# Altium schematic sheet PMSM_PDFan.SchDoc
size D; SheetNumber: 1; SheetTotal: 1
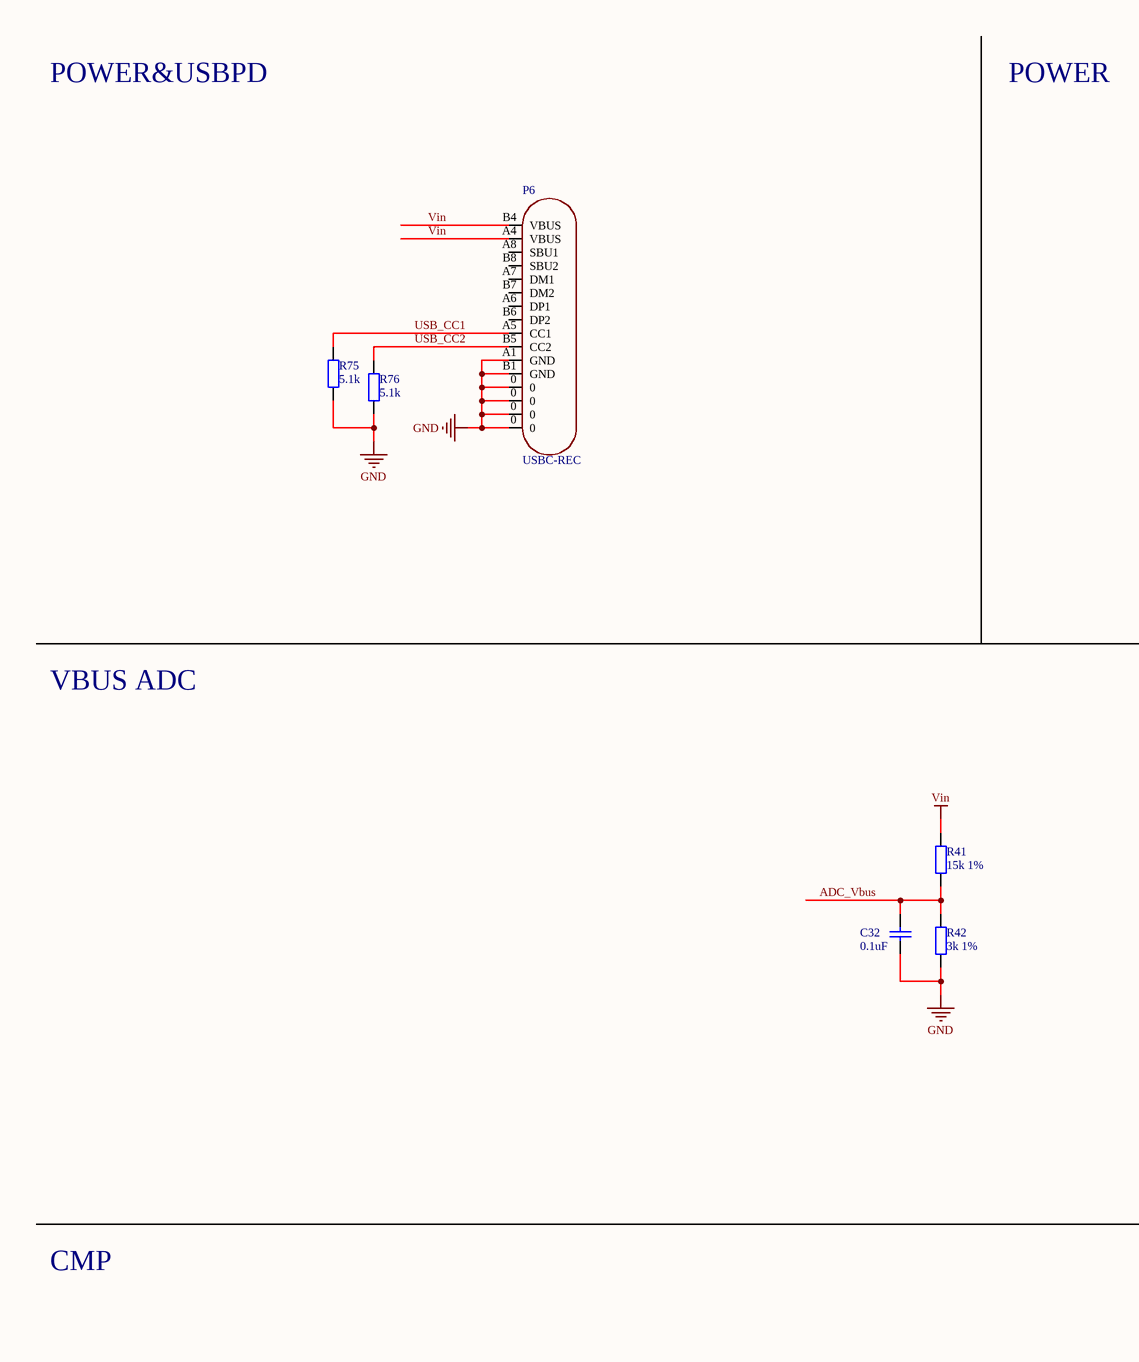
[diagram p0: PMSM_PDFan.SchDoc, top left]
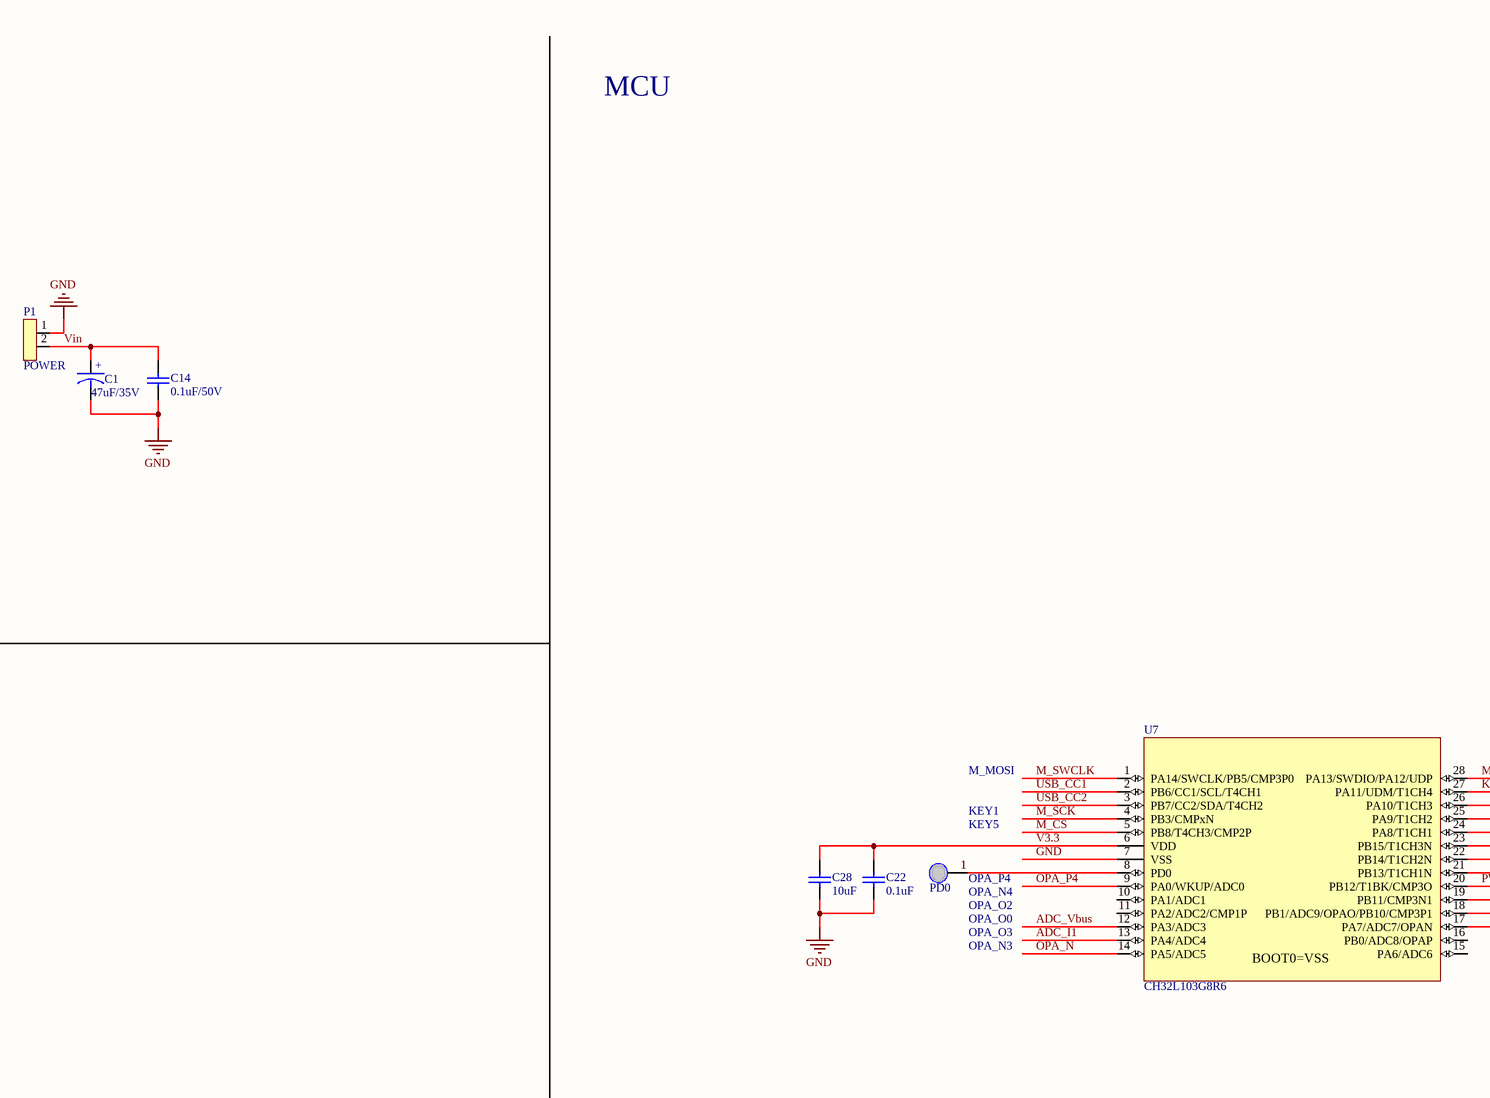
[diagram p1: PMSM_PDFan.SchDoc, top middle]
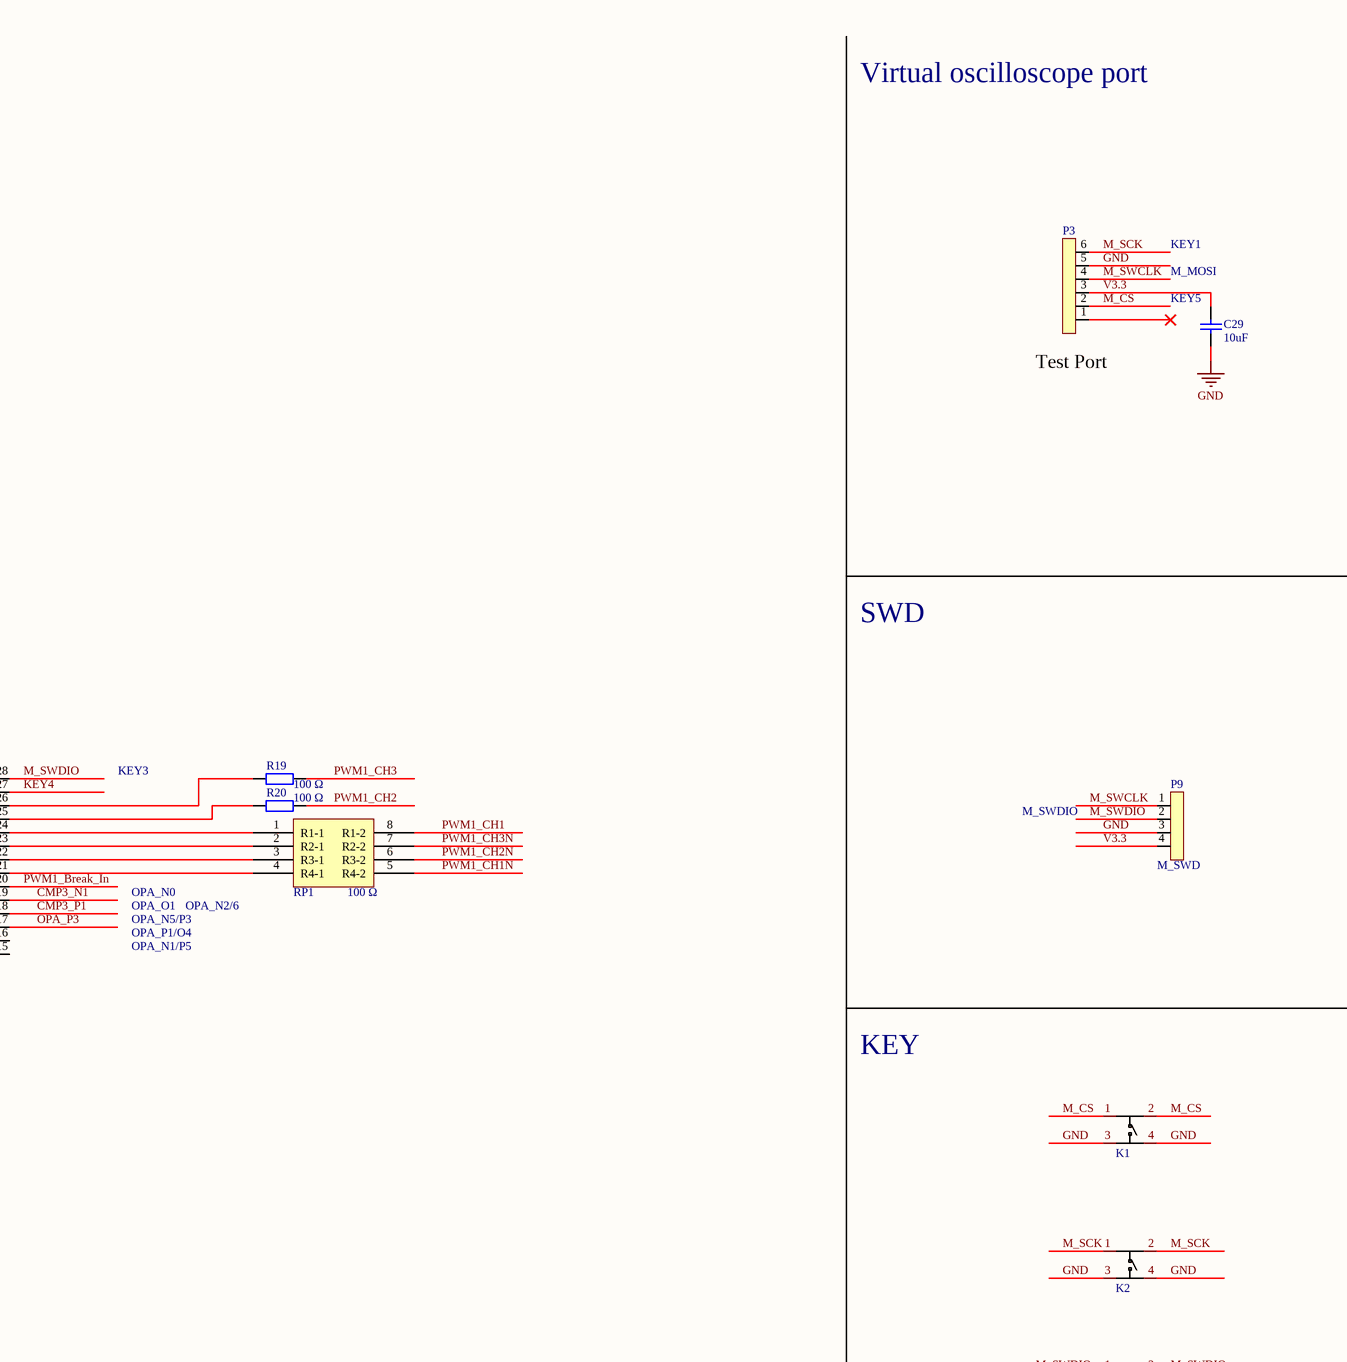
[diagram p2: PMSM_PDFan.SchDoc, top right]
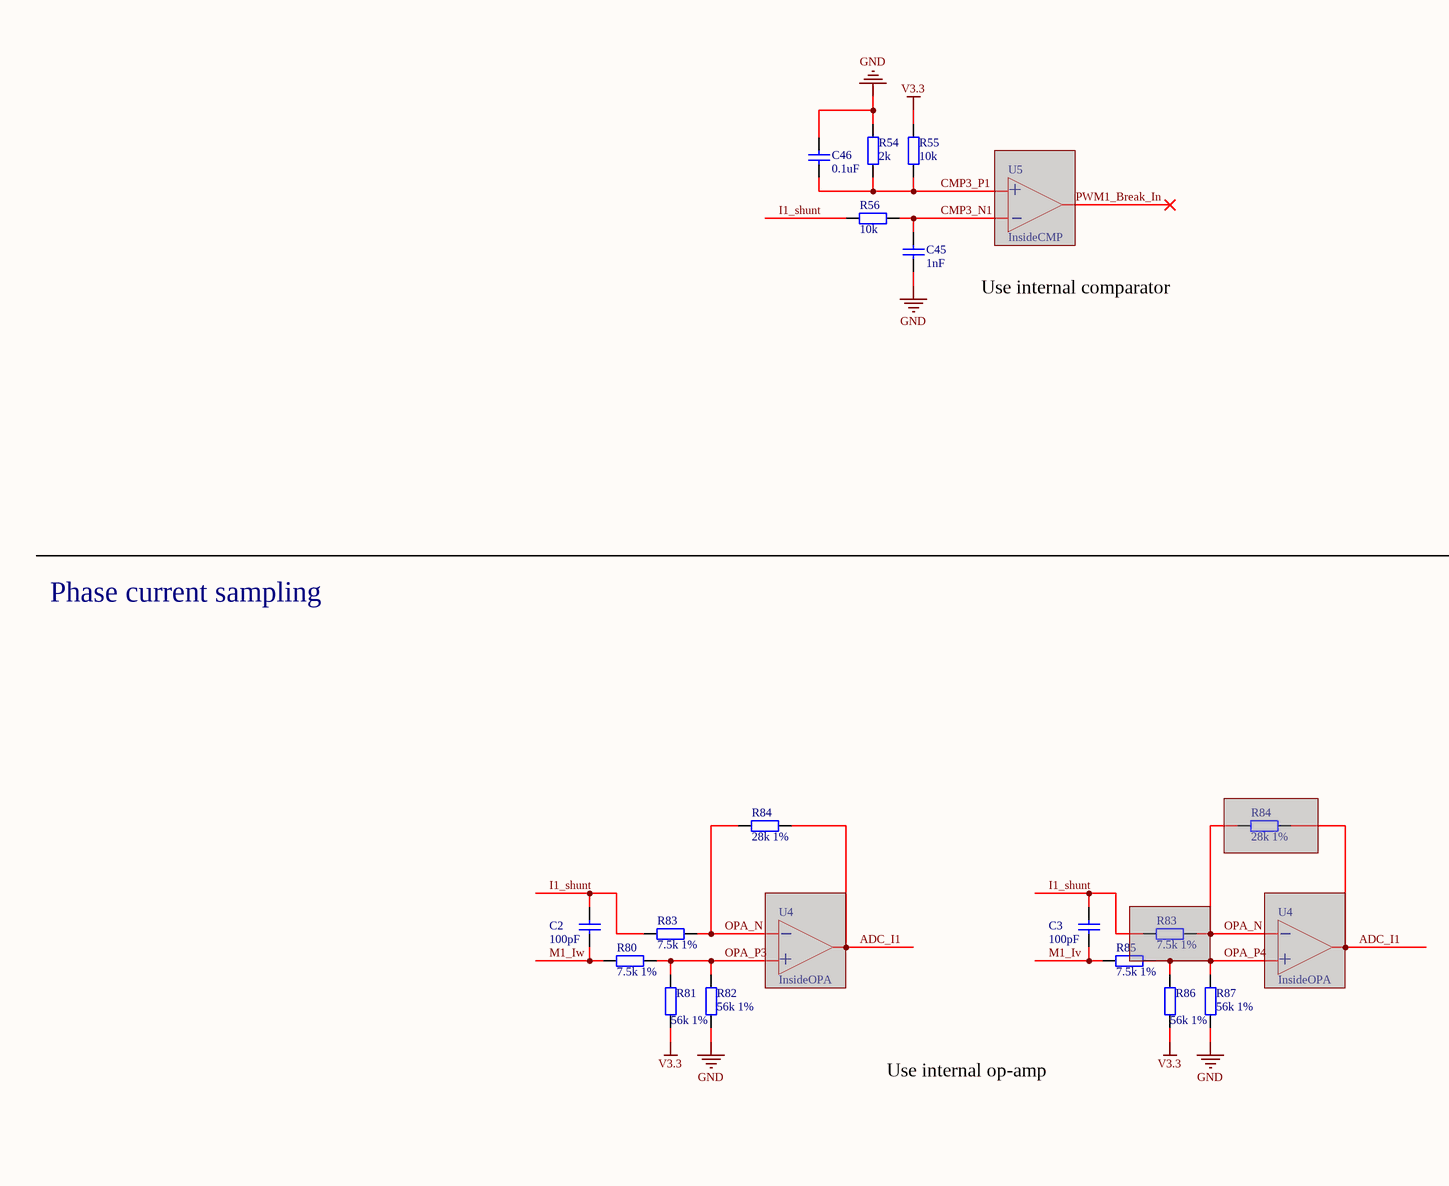
[diagram p3: PMSM_PDFan.SchDoc, bottom left]
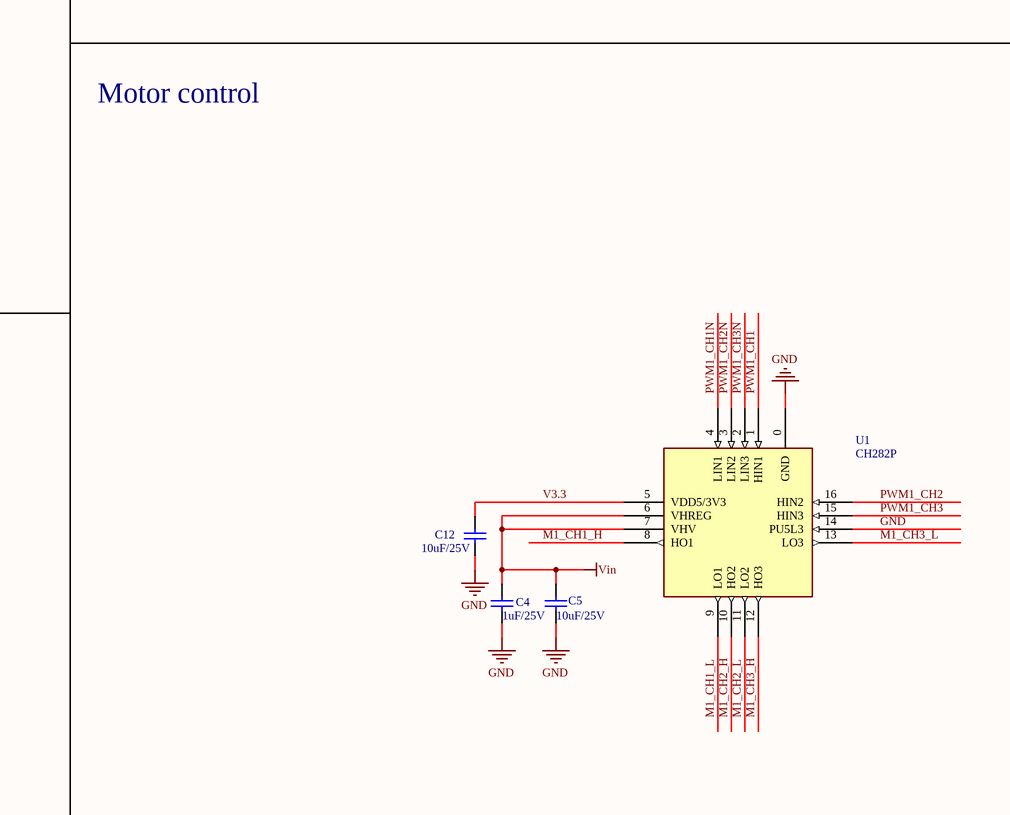
[diagram p4: PMSM_PDFan.SchDoc, bottom middle]
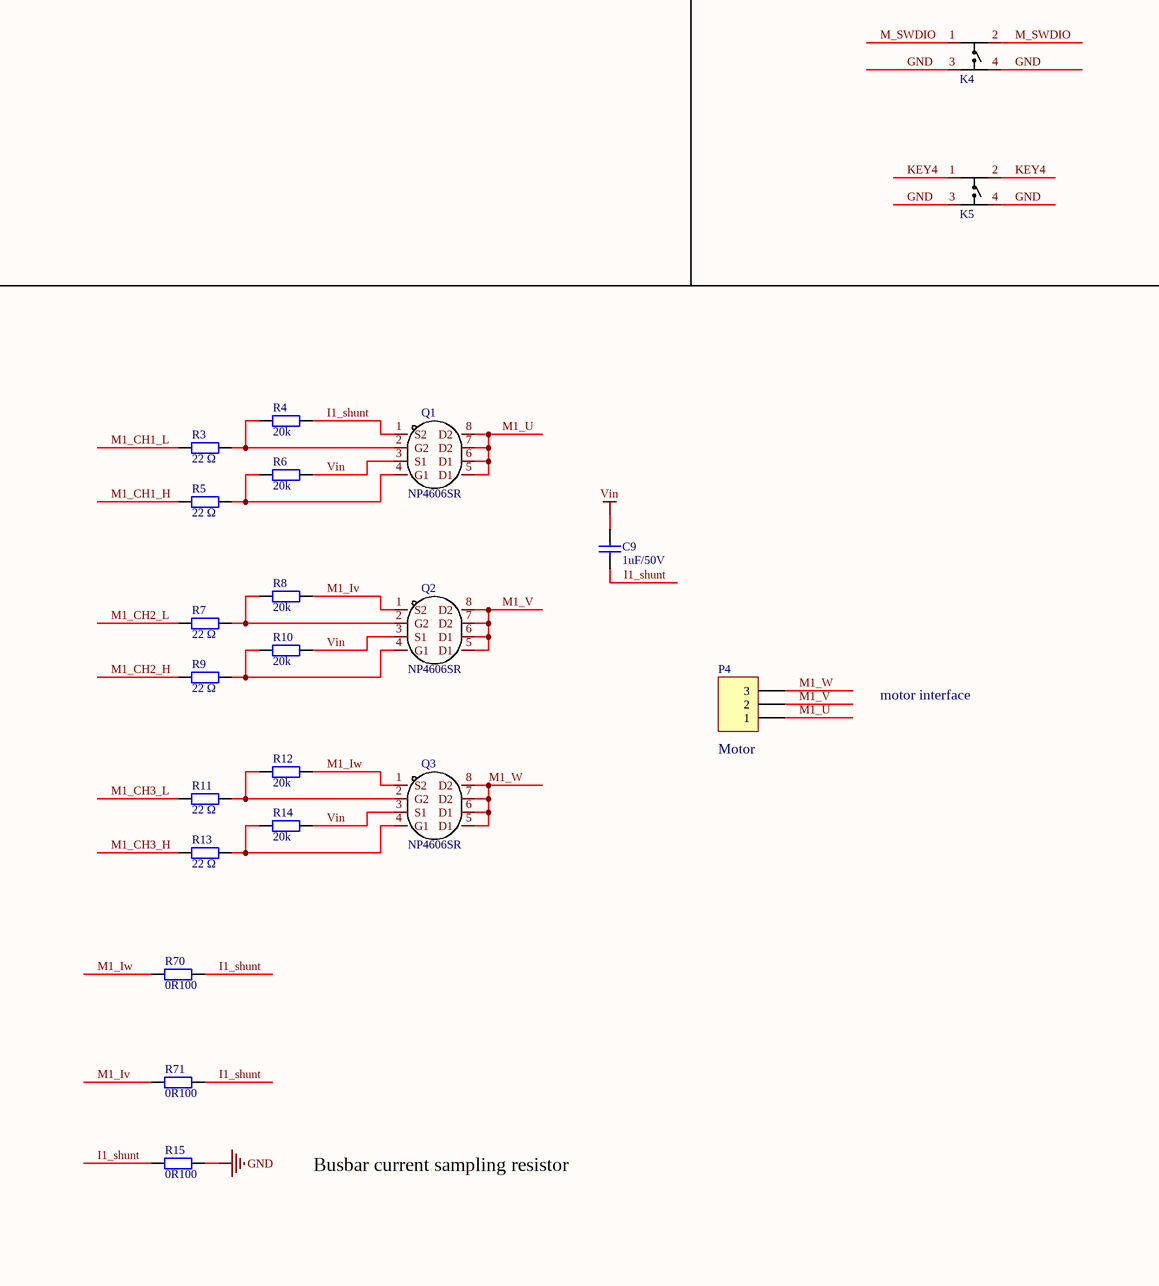
[diagram p5: PMSM_PDFan.SchDoc, bottom right]

## Parts
(Parts that share a designator on the sheet are numbered #1, #2 ... from top to bottom, then left to right.)
C1  47uF/35V  [M_C_RB_D10F5]
C2  100pF  [M_C0402-]
C3  100pF  [M_C0402-]
C4  1uF/25V  [M_C0603]
C5  10uF/25V  [M_C0805]
C9  1uF/50V  [M_C0805]
C12  10uF/25V  [M_C0603]
C14  0.1uF/50V  [M_C0402-]
C22  0.1uF  [M_C0402-]
C28  10uF  [M_C0603]
C29  10uF  [M_C0603]
C32  0.1uF  [M_C0402-]
C45  1nF  [M_C0402-]
C46  0.1uF  [M_C0402-]
K1  KH-6X6X8H-STM  [KEY2-SMD]  (value not drawn)
K2  KH-6X6X8H-STM  [KEY2-SMD]  (value not drawn)
K4  KH-6X6X8H-STM  [KEY2-SMD]  (value not drawn)
K5  KH-6X6X8H-STM  [KEY2-SMD]  (value not drawn)
P1  POWER  [WJ15EDGRC3.81-2]
P3  6PIN  [M_PIN2.54_6P]  (value not drawn)
P4  MHDR1X3  [WJ15EDGRC3.81-3]  (value not drawn)
P6  USBC-REC  [TYPE-C-Receptacle-2.0]
P9  M_SWD  [M_PIN2.54_4P]
PD0  Testpoint  [TEST-1.2]  (value not drawn)
Q1  NP4606SR  [SOP8]
Q2  NP4606SR  [SOP8]
Q3  NP4606SR  [SOP8]
R3  22 Ω  [M_R0402-]
R4  20k  [M_R0402-]
R5  22 Ω  [M_R0402-]
R6  20k  [M_R0402-]
R7  22 Ω  [M_R0402-]
R8  20k  [M_R0402-]
R9  22 Ω  [M_R0402-]
R10  20k  [M_R0402-]
R11  22 Ω  [M_R0402-]
R12  20k  [M_R0402-]
R13  22 Ω  [M_R0402-]
R14  20k  [M_R0402-]
R15  0R100  [M_R1206-]
R19  100 Ω  [M_R0402-]
R20  100 Ω  [M_R0402-]
R41  15k 1%  [M_R0603]
R42  3k 1%  [M_R0402-]
R54  2k  [M_R0402-]
R55  10k  [M_R0402-]
R56  10k  [M_R0402-]
R70  0R100  [M_R1206-]
R71  0R100  [M_R1206-]
R75  5.1k  [M_R0402-]
R76  5.1k  [M_R0402-]
R80  7.5k 1%  [M_R0402-]
R81  56k 1%  [M_R0402-]
R82  56k 1%  [M_R0402-]
R83#1  7.5k 1%  [M_R0402-]
R83#2  7.5k 1%  [M_R0402-]  (masked out: inside a compile mask, not in the netlist)
R84#1  28k 1%  [M_R0402-]
R84#2  28k 1%  [M_R0402-]  (masked out: inside a compile mask, not in the netlist)
R85  7.5k 1%  [M_R0402-]
R86  56k 1%  [M_R0402-]
R87  56k 1%  [M_R0402-]
RP1  100 Ω  [M_RP0402]
U1  CH282P  [QFN16_3X3]
U4#1  InsideOPA  (masked out: inside a compile mask, not in the netlist)
U4#2  InsideOPA  (masked out: inside a compile mask, not in the netlist)
U5  InsideCMP  (masked out: inside a compile mask, not in the netlist)
U7  CH32L103G8R6  [QSOP28]

## Nets
GND: C1.2 C4.2 C5.2 C12.2 C14.2 C22.2 C28.2 C29.2 C32.2 C45.1 C46.2 K1.3(C) K1.4(D) K2.3(C) K2.4(D) K4.3(C) K4.4(D) K5.3(C) K5.4(D) P1.1 P3.5 P6.0 P6.A1(GND) P6.B1(GND) P9.3 R15.1 R42.1 R54.1 R75.1 R76.1 R82.1 R87.1 U1.0(GND) U1.14(PU5L3) U7.7(VSS)
V3.3: C12.1 C22.1 C28.1 C29.1 P3.3 P9.4 R55.2 R81.1 R86.1 U1.5(VDD5/3V3) U7.6(VDD)
Vin: C1.1 C4.1 C5.1 C9.1 C14.1 P1.2 P6.A4(VBUS) P6.B4(VBUS) Q1.3(S1) Q2.3(S1) Q3.3(S1) R6.1 R10.1 R14.1 R41.2 U1.6(VHREG) U1.7(VHV)
ADC_I1: R84#1.2 U7.13(PA4/ADC4)
ADC_Vbus: C32.1 R41.1 R42.2 U7.12(PA3/ADC3)
CMP3_N1: C45.2 R56.2 U7.19(PB11/CMP3N1)
CMP3_P1: C46.1 R54.2 R55.1 U7.18(PB1/ADC9/OPAO/PB10/CMP3P1)
I1_shunt: C2.1 C3.1 C9.2 Q1.1(S2) R4.1 R15.2 R56.1 R70.1 R71.1 R83#1.1
KEY4: K5.1(A) K5.2(B) U7.27(PA11/UDM/T1CH4)
M1_CH1_H: R5.2 U1.8(HO1)
M1_CH1_L: R3.2 U1.9(LO1)
M1_CH2_H: R9.2 U1.10(HO2)
M1_CH2_L: R7.2 U1.11(LO2)
M1_CH3_H: R13.2 U1.12(HO3)
M1_CH3_L: R11.2 U1.13(LO3)
M1_Iv: C3.2 Q2.1(S2) R8.1 R71.2 R85.1
M1_Iw: C2.2 Q3.1(S2) R12.1 R70.2 R80.1
M1_U: P4.1 Q1.5(D1) Q1.6(D1) Q1.7(D2) Q1.8(D2)
M1_V: P4.2 Q2.5(D1) Q2.6(D1) Q2.7(D2) Q2.8(D2)
M1_W: P4.3 Q3.5(D1) Q3.6(D1) Q3.7(D2) Q3.8(D2)
M_CS: K1.1(A) K1.2(B) P3.2 U7.5(PB8/T4CH3/CMP2P)
M_SCK: K2.1(A) K2.2(B) P3.6 U7.4(PB3/CMPxN)
M_SWCLK: P3.4 P9.1 U7.1(PA14/SWCLK/PB5/CMP3P0)
M_SWDIO: K4.1(A) K4.2(B) P9.2 U7.28(PA13/SWDIO/PA12/UDP)
OPA_N: R83#1.2 R84#1.1 U7.14(PA5/ADC5)
OPA_P3: R80.2 R81.2 R82.2 U7.17(PA7/ADC7/OPAN)
OPA_P4: U7.9(PA0/WKUP/ADC0)
PWM1_Break_In: U7.20(PB12/T1BK/CMP3O)
PWM1_CH1: RP1.8(R1-2) U1.1(HIN1)
PWM1_CH1N: RP1.5(R4-2) U1.4(LIN1)
PWM1_CH2: R20.1 U1.16(HIN2)
PWM1_CH2N: RP1.6(R3-2) U1.3(LIN2)
PWM1_CH3: R19.1 U1.15(HIN3)
PWM1_CH3N: RP1.7(R2-2) U1.2(LIN3)
USB_CC1: P6.A5(CC1) R75.2 U7.2(PB6/CC1/SCL/T4CH1)
USB_CC2: P6.B5(CC2) R76.2 U7.3(PB7/CC2/SDA/T4CH2)
NetPD0_1: PD0.1 U7.8(PD0)
NetQ1_2: Q1.2(G2) R3.1 R4.2
NetQ1_4: Q1.4(G1) R5.1 R6.2
NetQ2_2: Q2.2(G2) R7.1 R8.2
NetQ2_4: Q2.4(G1) R9.1 R10.2
NetQ3_2: Q3.2(G2) R11.1 R12.2
NetQ3_4: Q3.4(G1) R13.1 R14.2
NetR19_2: R19.2 U7.26(PA10/T1CH3)
NetR20_2: R20.2 U7.25(PA9/T1CH2)
NetRP1_1: RP1.1(R1-1) U7.24(PA8/T1CH1)
NetRP1_2: RP1.2(R2-1) U7.23(PB15/T1CH3N)
NetRP1_3: RP1.3(R3-1) U7.22(PB14/T1CH2N)
NetRP1_4: RP1.4(R4-1) U7.21(PB13/T1CH1N)

Not connected (* = marked no-connect by the designer): P3 1*; P6 A6(DP1) A7(DM1) A8(SBU1) B6(DP2) B7(DM2) B8(SBU2); R85 2; R86 2; R87 2; U7 10(PA1/ADC1) 11(PA2/ADC2/CMP1P) 15(PA6/ADC6) 16(PB0/ADC8/OPAP)

## Notes on the sheet
- POWER&USBPD
- POWER
- Virtual oscilloscope port
- MCU
- (near C29) M_MOSI
- KEY1
- (near C29) KEY5
- (near P3) Test Port
- SWD
- VBUS ADC
- M_MOSI
- (near PD0) KEY5
- KEY3
- M_SWDIO
- (near PD0) OPA_P4
- (near PD0) OPA_N4
- OPA_N0
- (near PD0) OPA_O2
- (near PD0) OPA_O0
- OPA_O3
- OPA_N3
- OPA_N1/P5
- OPA_N5/P3
- OPA_P1/O4
- OPA_O1
- OPA_N2/6
- KEY
- CMP
- Use internal comparator
- Motor control
- Phase current sampling
- motor interface
- (near P4) Motor
- Use internal op-amp
- Busbar current sampling resistor
- Labels drawn without touching a wire or pin: OPA_N, OPA_P4
- (in symbol CAPACITOR POL_2) +
- (in symbol CH32L103G8R6) BOOT0=VSS
- (in symbol InsideOPA) +
- (in symbol InsideOPA2) +

## Library data of the parts
C1 = CAPACITOR POL_2: Capacitor; Value: 47uF/35V
C2-C5 C9 C12 C14 C22 C28 C29 C32 C45 C46 = Cap Semi: Capacitor (Semiconductor SIM Model); Published: 8-Jun-2000; LatestRevisionDate: 17-Jul-2002; LatestRevisionNote: Re-released for DXP Platform.; PackageReference: C0805; Publisher: Altium Limited
  C2 C3: Value: 100pF
  C4: Value: 1uF/25V
  C5 C12: Value: 10uF/25V
  C9: Value: 1uF/50V
  C14: Value: 0.1uF/50V
  C22 C32 C46: Value: 0.1uF
  C28 C29: Value: 10uF
  C45: Value: 1nF
K1 K2 K4 K5 = KH-6X6X8H-STM: Add into BOM: yes; Contact Current: 50mA; Voltage Rating (DC): 12V; Mechanical Life: 80000; Switch Length: 6mm; Name: KH-6X6X8H-STM; Symbol: KH-6X6X8H-STM; Device: KH-6X6X8H-STM; LCSC Part Name: KH-6X6X8H-STM; Supplier Part: C2837534; Manufacturer Part: KH-6X6X8H-STM; Supplier Footprint: SMD; JLCPCB Part Class: Extended Part; Datasheet: https://atta.szlcsc.com/upload/public/pdf/source/20210608/C2837534_94EAC7D8AFBB996E2814FACF50FEEF85.pdf; Supplier: LCSC; Convert to PCB: yes; Voltage Rating (AC): -; Power Rating: -; With Lamp: -; Operating Force: -; Operating Temperature: -; IP Rating: -; Switch Width: 6mm; Switch Height: -
P1 = 2PIN
P4 = MHDR1X3: Header, 3-Pin; LatestRevisionDate: 17-Jul-2002; LatestRevisionNote: Re-released for DXP Platform.; Publisher: Altium Limited
P6 = USBC-REC: USB Type-C USB
P9 = 4PIN
PD0 = Testpoint: 测试点
Q1-Q3 = NP9926BSR-G: Add into BOM: yes; Drain Source Voltage (Vdss): 20V; Continuous Drain Current (Id): 6A; Power Dissipation (Pd): 1.25W; Gate Threshold Voltage (Vgs(th)@Id): 700mV@250uA; Total Gate Charge (Qg@Vgs): 12nC@4.5V; Input Capacitance (Ciss@Vds): 900pF@10V; Reverse Transfer Capacitance (Crss@Vds): 100pF@10V; Symbol: NP9926BSR-G; Device: NP9926BSR-G; Supplier Part: C2991134; Manufacturer Part: NP9926BSR-G; Supplier Footprint: SOP-8; JLCPCB Part Class: Extended Part; Datasheet: https://atta.szlcsc.com/upload/public/pdf/source/20220426/45EDAE8AA532D945771DBC41E7CE2370.pdf; Supplier: LCSC; Convert to PCB: yes
R3-R15 R19 R20 R41 R42 R54-R56 R70 R71 R75 R76 R80-R82 R83#1 R83#2 R84#1 R84#2 R85-R87 = Res2: Resistor; Published: 8-Jun-2000; LatestRevisionDate: 17-Jul-2002; LatestRevisionNote: Re-released for DXP Platform.; PackageReference: AXIAL-0.4; Publisher: Altium Limited
  R3 R5 R7 R9 R11 R13: Value: 22 Ω
  R4 R6 R8 R10 R12 R14: Value: 20k
  R15 R70 R71: Value: 0R100
  R19 R20: Value: 100 Ω
  R41: Value: 15k 1%
  R42: Value: 3k 1%
  R54: Value: 2k
  R55 R56: Value: 10k
  R75 R76: Value: 5.1k
  R80 R83#1 R83#2 R85: Value: 7.5k 1%
  R81 R82 R86 R87: Value: 56k 1%
  R84#1 R84#2: Value: 28k 1%
RP1 = Rp4: Value: 100 Ω
U1 = CH282P: three-phase P/NMOS gate driver with LDO
U5 = InsideOPA2
U7 = CH32L103G8R6: RISC-V LMD-MCU, 96MHz, USB, Type-C, CAN, OPA, lower power